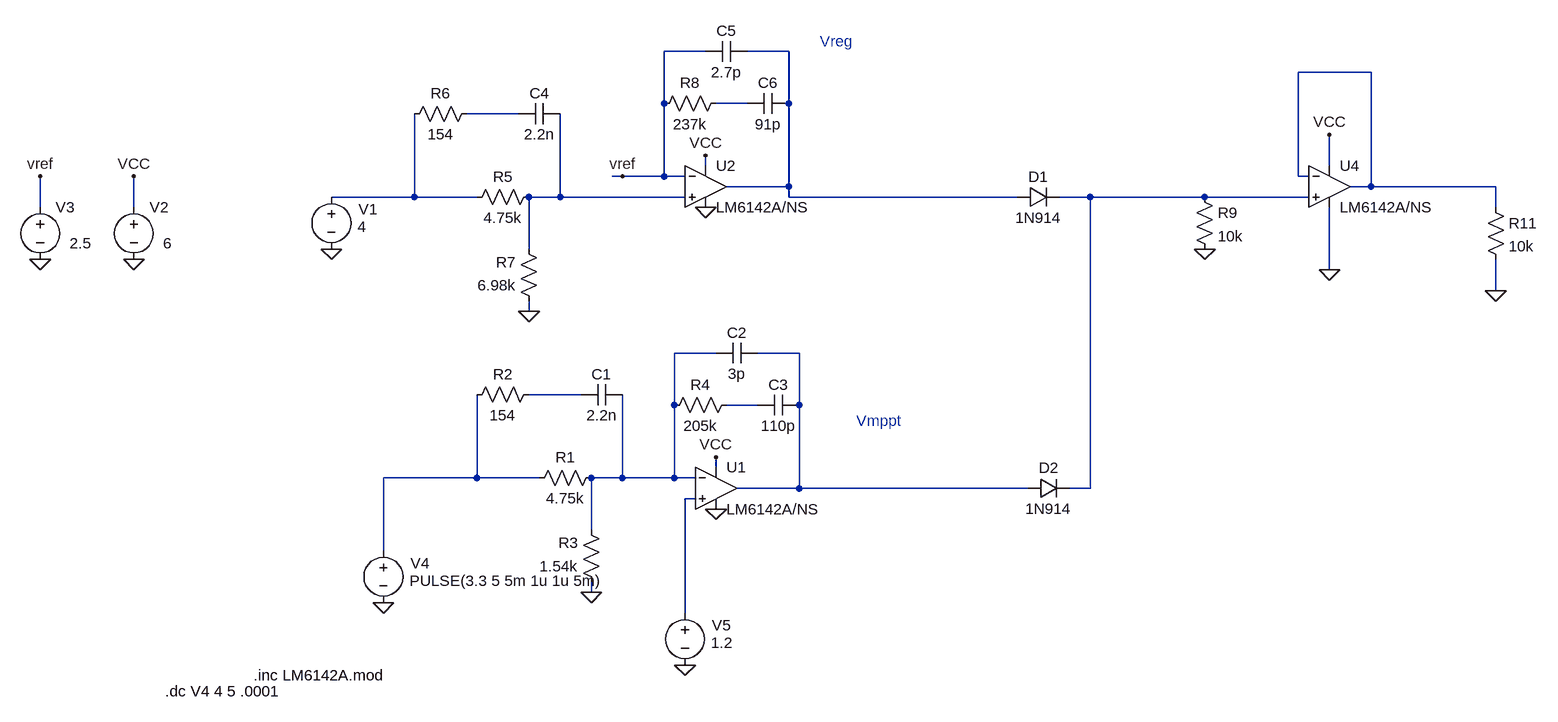
[diagram p0: schematic Compensated-Error-Amplifiers.asc]
Compensated-Error-Amplifiers.asc, the LTspice schematic file:
Version 4
SHEET 1 1784 680
WIRE 496 -560 432 -560
WIRE 624 -560 560 -560
WIRE 1520 -528 1408 -528
WIRE 432 -480 432 -560
WIRE 560 -480 512 -480
WIRE 624 -480 624 -560
WIRE 208 -464 128 -464
WIRE 496 -384 496 -400
WIRE 1456 -384 1456 -432
WIRE 368 -368 352 -368
WIRE 432 -368 432 -480
WIRE 432 -368 368 -368
WIRE 464 -368 432 -368
WIRE 1408 -368 1408 -528
WIRE 1424 -368 1408 -368
WIRE 624 -352 624 -480
WIRE 624 -352 528 -352
WIRE 1520 -352 1520 -528
WIRE 1520 -352 1488 -352
WIRE 1712 -352 1520 -352
WIRE 48 -336 48 -464
WIRE 48 -336 -80 -336
WIRE 144 -336 48 -336
WIRE 272 -336 272 -464
WIRE 272 -336 224 -336
WIRE 464 -336 272 -336
WIRE 624 -336 624 -352
WIRE 976 -336 624 -336
WIRE 1088 -336 1040 -336
WIRE 1264 -336 1088 -336
WIRE 1424 -336 1264 -336
WIRE -528 -320 -528 -368
WIRE -384 -320 -384 -368
WIRE 1712 -320 1712 -352
WIRE 224 -256 224 -336
WIRE 1456 -224 1456 -320
WIRE 1712 -192 1712 -240
WIRE 224 -160 224 -176
WIRE 512 -96 448 -96
WIRE 640 -96 576 -96
WIRE 304 -32 224 -32
WIRE 448 -16 448 -96
WIRE 576 -16 528 -16
WIRE 640 -16 640 -96
WIRE 512 80 512 64
WIRE 144 96 144 -32
WIRE 144 96 0 96
WIRE 240 96 144 96
WIRE 368 96 368 -32
WIRE 368 96 320 96
WIRE 448 96 448 -16
WIRE 448 96 368 96
WIRE 480 96 448 96
WIRE 640 112 640 -16
WIRE 640 112 544 112
WIRE 992 112 640 112
WIRE 1088 112 1088 -336
WIRE 1088 112 1056 112
WIRE 480 128 464 128
WIRE 320 176 320 96
WIRE 0 208 0 96
WIRE 320 272 320 256
WIRE 464 304 464 128
FLAG -80 -256 0
FLAG 320 272 0
FLAG 512 144 0
FLAG -384 -240 0
FLAG -384 -368 VCC
FLAG 512 64 VCC
FLAG -528 -240 0
FLAG -528 -368 vref
FLAG 224 -160 0
FLAG 496 -320 0
FLAG 496 -400 VCC
FLAG 0 288 0
FLAG 1712 -192 0
FLAG 368 -368 vref
FLAG 464 384 0
FLAG 1456 -224 0
FLAG 1456 -432 VCC
FLAG 1264 -256 0
SYMBOL voltage -80 -352 R0
WINDOW 3 40 62 Left 2
WINDOW 123 24 124 Left 2
WINDOW 39 0 0 Left 2
WINDOW 0 42 35 Left 2
SYMATTR Value 4
SYMATTR InstName V1
SYMBOL res 336 80 R90
WINDOW 0 0 56 VBottom 2
WINDOW 3 32 56 VTop 2
SYMATTR InstName R1
SYMATTR Value 4.75k
SYMBOL res 240 -48 R90
WINDOW 0 0 56 VBottom 2
WINDOW 3 32 56 VTop 2
SYMATTR InstName R2
SYMATTR Value 154
SYMBOL res 336 272 R180
WINDOW 0 36 76 Left 2
WINDOW 3 36 40 Left 2
SYMATTR InstName R3
SYMATTR Value 1.54k
SYMBOL Opamps\\opamp2 512 48 R0
SYMATTR InstName U1
SYMATTR Value LM6142A/NS
SYMBOL res 544 -32 R90
WINDOW 0 0 56 VBottom 2
WINDOW 3 32 56 VTop 2
SYMATTR InstName R4
SYMATTR Value 205k
SYMBOL cap 368 -48 R90
WINDOW 0 0 32 VBottom 2
WINDOW 3 32 32 VTop 2
SYMATTR InstName C1
SYMATTR Value 2.2n
SYMBOL cap 576 -112 R90
WINDOW 0 0 32 VBottom 2
WINDOW 3 32 32 VTop 2
SYMATTR InstName C2
SYMATTR Value 3p
SYMBOL cap 640 -32 R90
WINDOW 0 0 32 VBottom 2
WINDOW 3 32 32 VTop 2
SYMATTR InstName C3
SYMATTR Value 110p
SYMBOL voltage -384 -336 R0
WINDOW 3 45 71 Left 2
WINDOW 123 24 124 Left 2
WINDOW 39 0 0 Left 2
SYMATTR Value 6
SYMATTR InstName V2
SYMBOL voltage -528 -336 R0
WINDOW 3 45 71 Left 2
WINDOW 123 24 124 Left 2
WINDOW 39 0 0 Left 2
SYMATTR Value 2.5
SYMATTR InstName V3
SYMBOL res 240 -352 R90
WINDOW 0 0 56 VBottom 2
WINDOW 3 32 56 VTop 2
SYMATTR InstName R5
SYMATTR Value 4.75k
SYMBOL res 144 -480 R90
WINDOW 0 0 56 VBottom 2
WINDOW 3 32 56 VTop 2
SYMATTR InstName R6
SYMATTR Value 154
SYMBOL res 240 -160 R180
WINDOW 0 36 76 Left 2
WINDOW 3 36 40 Left 2
SYMATTR InstName R7
SYMATTR Value 6.98k
SYMBOL Opamps\\opamp2 496 -416 R0
SYMATTR InstName U2
SYMATTR Value LM6142A/NS
SYMBOL res 528 -496 R90
WINDOW 0 0 56 VBottom 2
WINDOW 3 32 56 VTop 2
SYMATTR InstName R8
SYMATTR Value 237k
SYMBOL cap 272 -480 R90
WINDOW 0 0 32 VBottom 2
WINDOW 3 32 32 VTop 2
SYMATTR InstName C4
SYMATTR Value 2.2n
SYMBOL cap 560 -576 R90
WINDOW 0 0 32 VBottom 2
WINDOW 3 32 32 VTop 2
SYMATTR InstName C5
SYMATTR Value 2.7p
SYMBOL cap 624 -496 R90
WINDOW 0 0 32 VBottom 2
WINDOW 3 32 32 VTop 2
SYMATTR InstName C6
SYMATTR Value 91p
SYMBOL voltage 0 192 R0
WINDOW 3 40 62 Left 2
WINDOW 123 24 124 Left 2
WINDOW 39 0 0 Left 2
WINDOW 0 42 35 Left 2
SYMATTR Value PULSE(3.3 5 5m 1u 1u 5m)
SYMATTR InstName V4
SYMBOL diode 976 -320 R270
WINDOW 0 32 32 VTop 2
WINDOW 3 0 32 VBottom 2
SYMATTR InstName D1
SYMATTR Value 1N914
SYMBOL res 1696 -336 R0
SYMATTR InstName R11
SYMATTR Value 10k
SYMBOL voltage 464 288 R0
WINDOW 3 40 62 Left 2
WINDOW 123 24 124 Left 2
WINDOW 39 0 0 Left 2
WINDOW 0 42 35 Left 2
SYMATTR Value 1.2
SYMATTR InstName V5
SYMBOL diode 992 128 R270
WINDOW 0 32 32 VTop 2
WINDOW 3 0 32 VBottom 2
SYMATTR InstName D2
SYMATTR Value 1N914
SYMBOL Opamps\\opamp2 1456 -416 R0
SYMATTR InstName U4
SYMATTR Value LM6142A/NS
SYMBOL res 1248 -352 R0
SYMATTR InstName R9
SYMATTR Value 10k
TEXT -200 400 Left 2 !.inc LM6142A.mod
TEXT -336 424 Left 2 !.dc V4 4 5 .0001
TEXT 672 -576 Left 2 ;Vreg
TEXT 728 8 Left 2 ;Vmppt

The netlist it stands for:
* Compensated-Error-Amplifiers.asc
V1 N005 0 4
R1 N008 N012 4.75k
R2 N010 N012 154
R3 0 N008 1.54k
XU1 N013 N008 VCC 0 N009 LM6142A/NS  ; pins In+ In- V+ V- OUT
R4 N011 N008 205k
C1 N008 N010 2.2n
C2 N009 N008 3p
C3 N009 N011 110p
V2 VCC 0 6
V3 vref 0 2.5
R5 N006 N005 4.75k
R6 N004 N005 154
R7 0 N006 6.98k
XU2 N006 vref VCC 0 N001 LM6142A/NS  ; pins In+ In- V+ V- OUT
R8 N003 vref 237k
C4 N006 N004 2.2n
C5 N001 vref 2.7p
C6 N001 N003 91p
V4 N012 0 PULSE(3.3 5 5m 1u 1u 5m)
D1 N001 N007 1N914
R11 N002 0 10k
V5 N013 0 1.2
D2 N009 N007 1N914
XU4 N007 N002 VCC 0 N002 LM6142A/NS  ; pins In+ In- V+ V- OUT
R9 N007 0 10k
.model D D
.lib standard.dio
.inc LM6142A.mod
.dc V4 4 5 .0001
* Vreg
* Vmppt
.backanno
.end